# Altium schematic sheet 1_供电电路.schdoc
size 309 x 223 mm; Symbol: Sheet-Symbol_A4; Device: Sheet-Symbol_A4; @Page Name: 供电电路; @Create Date: 2023-06-22; @Page Count: 1; @Page No: 1; @Project Name: LED点阵最终版; @Schematic Name: Schematic2; @Update Date: 2023-06-22; Company: 嘉立创EDA; Page Size: A4; Version: V1.0
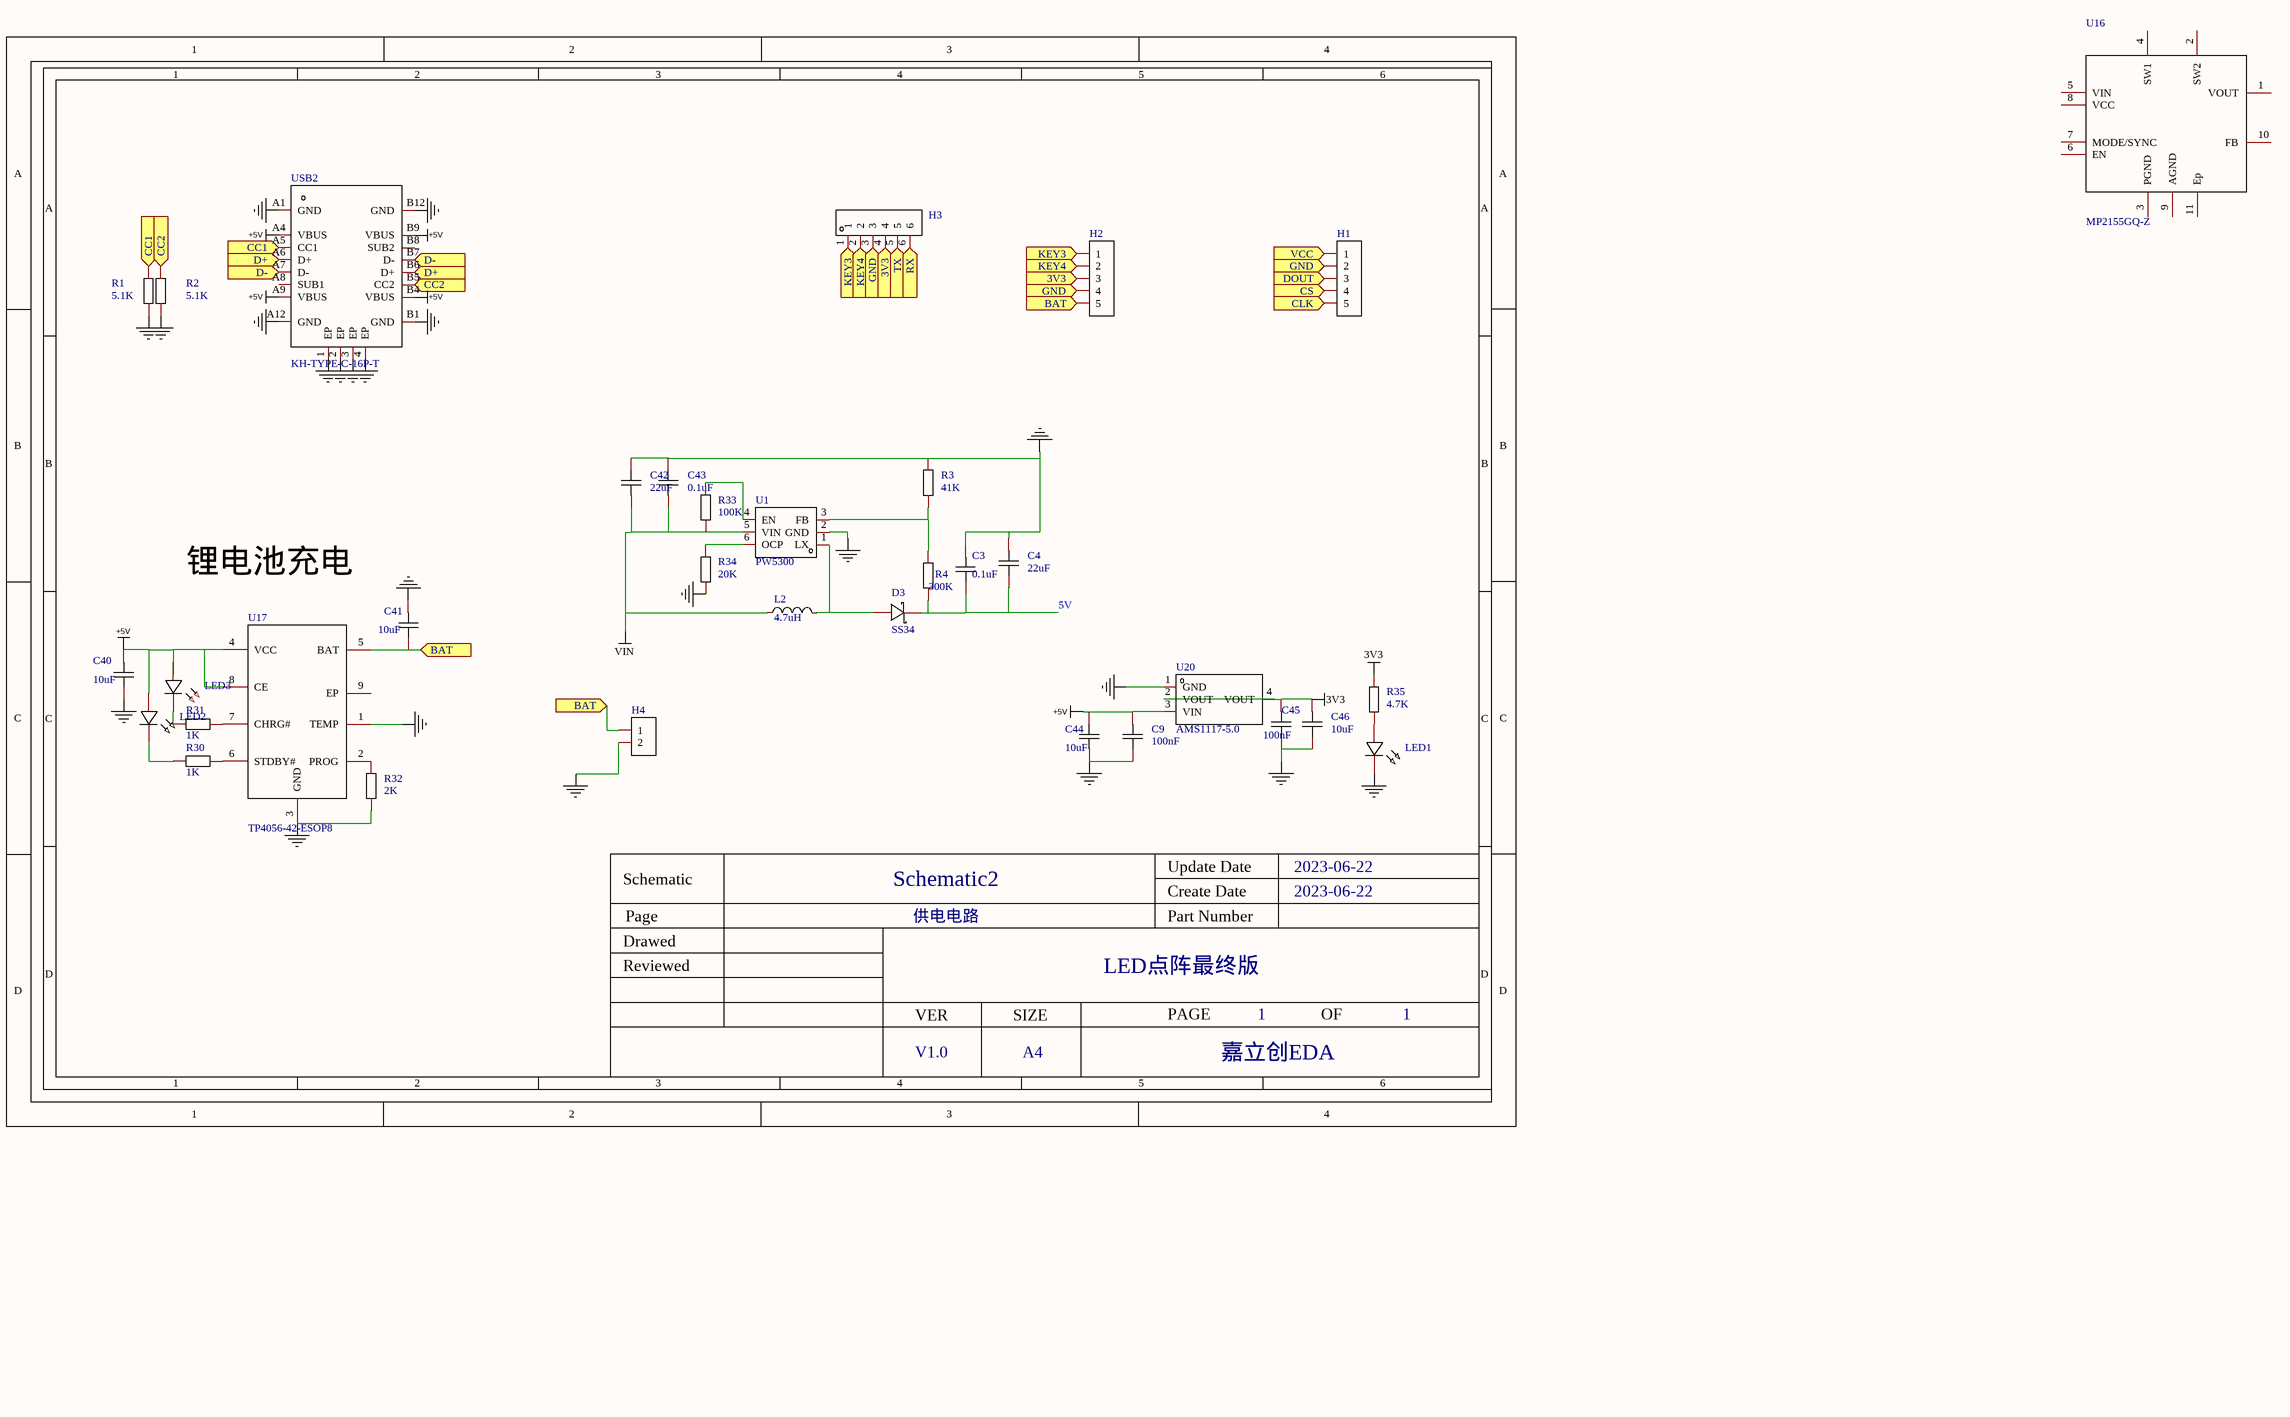
[diagram p0: 1_供电电路.schdoc]

## Parts
C3  0.1uF  [C0603]
C4  22uF  [C0603]
C9  100nF  [C0603]
C40  10uF  [C0603]
C41  10uF  [C0603]
C42  22uF  [C0603]
C43  0.1uF  [C0603]
C44  10uF  [C0603]
C45  100nF  [C0603]
C46  10uF  [C0603]
D3  SS34  [SMA_L4.3-W2.6-LS5.2-RD]
H1  HDR-F_2.54_1x5P  [HDR-TH_5P-P2.54-V-F]  (value not drawn)
H2  HDR-F_2.54_1x5P  [HDR-TH_5P-P2.54-V-F]  (value not drawn)
H3  HDR-F_2.54_1x6P  [HDR-TH_6P-P2.54-V-F]  (value not drawn)
H4  HDR-F_2.54_1x2P  [HDR-TH_2P-P2.54-V-F]  (value not drawn)
L2  4.7uH  [IND-SMD_L4.9-W4.4_MAPM0420F]
LED1  LED_0603-R  [LED_0603]  (value not drawn)
LED2  LED_0603-R  [LED_0603]  (value not drawn)
LED3  LED_0603-G  [LED_0603]  (value not drawn)
R1  5.1K  [R0603]
R2  5.1K  [R0603]
R3  41K  [R0603]
R4  300K  [R0603]
R30  1K  [R0603]
R31  1K  [R0603]
R32  2K  [R0603]
R33  100K  [R0603]
R34  20K  [R0603]
R35  4.7K  [R0603]
U1  PW5300  [SOT-23-6_L2.9-W1.6-P0.95-LS2.8-BL]
U16  MP2155GQ-Z  [QFN-10_L3.0-W3.0-P0.50-LS3.0-BL-EP]
U17  TP4056-42-ESOP8  [ESOP-8_L4.9-W3.9-P1.27-LS6.0-BL-EP]
U20  AMS1117-5.0  [SOT-223_L6.5-W3.5-P2.30-LS7.0-BR]
USB2  KH-TYPE-C-16P-T  [USB-C-SMD_KH-TYPE-C-16P]

## Ports
3V3 (in), BAT (in), CC1 (in), CC2 (in), CLK (in), CS (in), D+ (in), D- (in), DOUT (in), GND (in), KEY3 (in), KEY4 (in), RX (in), TX (in), VCC (in)

## Nets
3V3: C45.2 C46.2 R35.2 U20.2(VOUT) U20.4(VOUT)
+5V: C9.2 C40.2 C44.1 LED2.2(A) LED3.2(A) U17.4(VCC) U17.8(CE) U20.3(VIN) USB2.A4(VBUS) USB2.A9(VBUS) USB2.B4(VBUS) USB2.B9(VBUS)
NetC3_2: C3.2 C4.2 C9.1 C40.1 C41.2 C42.1 C43.1 C44.2 C45.1 C46.1 H4.2 LED1.1(C) R1.1 R2.1 R3.2 R32.2 R34.1 U1.2(GND) U17.1(TEMP) U17.3(GND) U20.1(GND) USB2.1(EP) USB2.2(EP) USB2.3(EP) USB2.4(EP) USB2.A1(GND) USB2.A12(GND) USB2.B1(GND) USB2.B12(GND)
VIN: C42.2 C43.2 L2.1 R33.2 U1.5(VIN)
3V3: H2.3 H3.4 ; port 3V3  [a separate net that carries the same name]
5V: C3.1 C4.1 D3.1(K) R4.1
BAT: C41.1 H2.5 H4.1 U17.5(BAT) ; port BAT
CC1: R1.2 USB2.A5(CC1) ; port CC1
CC2: R2.2 USB2.B5(CC2) ; port CC2
CLK: H1.5 ; port CLK
CS: H1.4 ; port CS
D+: USB2.A6(D+) USB2.B6(D+) ; port D+
D-: USB2.A7(D-) USB2.B7(D-) ; port D-
DOUT: H1.3 ; port DOUT
GND: H1.2 H2.4 H3.3 ; port GND
KEY3: H2.1 H3.1 ; port KEY3
KEY4: H2.2 H3.2 ; port KEY4
RX: H3.6 ; port RX
TX: H3.5 ; port TX
VCC: H1.1 ; port VCC
NetD3_2: D3.2(A) L2.2 U1.1(LX)
NetLED1_2: LED1.2(A) R35.1
NetLED2_1: LED2.1(C) R30.2
NetLED3_1: LED3.1(C) R31.2
NetR3_1: R3.1 R4.2 U1.3(FB)
NetR30_1: R30.1 U17.6(STDBY#)
NetR31_1: R31.1 U17.7(CHRG#)
NetR32_1: R32.1 U17.2(PROG)
NetR33_1: R33.1 U1.4(EN)
NetR34_2: R34.2 U1.6(OCP)

Not connected (* = marked no-connect by the designer): U16 1(VOUT) 2(SW2) 3(PGND) 4(SW1) 5(VIN) 6(EN) 7(MODE/SYNC) 8(VCC) 9(AGND) 10(FB) 11(Ep); U17 9(EP); USB2 A8(SUB1) B8(SUB2)

## Notes on the sheet
- 锂电池充电
- 1
- 2
- 3
- 4
- 5
- 6
- A
- B
- C
- Schematic
- Schematic2
- Create Date
- Update Date
- 2023-06-22
- Reviewed
- Drawed
- Page
- 供电电路
- Part Number
- LED点阵最终版
- D
- VER
- SIZE
- PAGE
- OF
- V1.0
- A4
- 嘉立创EDA

## Library data of the parts
C3 C4 C9 C40-C46 = CAP_0603: Symbol: CapAcitance; Convert to PCB: yes; Device: CAP_0603; Add into BOM: yes; Supplier Footprint: 0603
  C3 C43: Name: 0.1uF; Value: 0.1uF
  C4 C42: Name: 22uF; Value: 22uF
  C9 C45: Name: 100nF; Value: 100nF
  C40 C41 C44 C46: Name: 10uF; Value: 10uF
D3 = SS34_C8678: 二极管配置:独立式;直流反向耐压(Vr):40V;平均整流电流(Io):3A;正向压降(Vf):550mV@3A;; Manufacturer: MDD; Add into BOM: yes; Diode Configuration: 独立式; Reverse Voltage (Vr): 40V; Average Rectified Current (Io): 3A; Reverse Leakage Current (Ir): 500uA@40V; Name: SS34; Symbol: SS34_C8678; Device: SS34_C8678; LCSC Part Name: 40V 3A 550mV@3A; Supplier Part: C8678; Manufacturer Part: SS34; Supplier Footprint: SMA(DO-214AC); JLCPCB Part Class: Basic Part; Datasheet: https://atta.szlcsc.com/upload/public/pdf/source/20230314/A80AE34493C69B89E2F4B1712F433538.pdf; Supplier: LCSC; Convert to PCB: yes; Forward Voltage (Vf@If): 550mV@3A
H1 H2 = HDR-F_2.54_1x5P: Symbol: Header-Female-2.54_1x5; Convert to PCB: yes; Device: HDR-F_2.54_1x5P; Add into BOM: yes; Supplier Part: C50950; Supplier Footprint: 插件
H3 = HDR-F_2.54_1x6P: Symbol: Header-Female-2.54_1x6; Convert to PCB: yes; Device: HDR-F_2.54_1x6P; Add into BOM: yes; Supplier Part: C40877; Supplier Footprint: 插件
H4 = HDR-F_2.54_1x2P: Symbol: Header-Female-2.54_1x2; Convert to PCB: yes; Device: HDR-F_2.54_1x2P; Add into BOM: yes; Supplier Part: C49661; Supplier Footprint: 插件
L2 = HA42-4R7MT: 电感值:4.7uH;精度:±20%;额定电流:2A;饱和电流(Isat):3A;; Manufacturer: FH(风华); Add into BOM: yes; Tolerance: ±20%; Rated Current: 2A; Saturation Current (Isat): 3A; DC Resistance (DCR): 150mΩ; Name: 4.7uH; Symbol: HA42-4R7MT; Device: HA42-4R7MT; LCSC Part Name: 4.7uH ±20% 2A 150mΩ; Supplier Part: C2936653; Manufacturer Part: HA42-4R7MT; Supplier Footprint: 0420; JLCPCB Part Class: Extended Part; Datasheet: https://atta.szlcsc.com/upload/public/pdf/source/20211228/DF5AAD1C624D1DACD739A51BD94418BC.pdf; Supplier: LCSC; Convert to PCB: yes; Value: 4.7uH; Ratings: -
LED1 LED2 = LED_0603-R: Symbol: LED_R; Convert to PCB: yes; Device: LED_0603-R; Add into BOM: yes; Supplier Footprint: 0603
LED3 = LED_0603-G: Symbol: LED_G; Convert to PCB: yes; Device: LED_0603-G; Add into BOM: yes; Supplier Footprint: 0603
R1-R4 R30-R35 = Res_0603: Symbol: 电阻; Convert to PCB: yes; Device: Res_0603; Add into BOM: yes; Supplier Footprint: 0603
  R1 R2: Name: 5.1K; Value: 5.1K
  R3: Name: 41K; Value: 41K
  R4: Name: 300K; Value: 300K
  R30 R31: Name: 1K; Value: 1K
  R32: Name: 2K; Value: 2K
  R33: Name: 100K; Value: 100K
  R34: Name: 20K; Value: 20K
  R35: Name: 4.7K; Value: 4.7K
U1 = PW5300: Add into BOM: yes; Name: PW5300; Symbol: PW5300; Device: PW5300; LCSC Part Name: PW5300; Supplier Part: C9900019345; Manufacturer Part: PW5300; Supplier Footprint: SOT-23-6; JLCPCB Part Class: Extended Part; Datasheet: https://atta.szlcsc.comnull; Supplier: LCSC; Convert to PCB: yes
U16 = MP2155GQ-Z: -; Manufacturer: MPS; Add into BOM: yes; Name: MP2155GQ-Z; Symbol: MP2155GQ-Z; Device: MP2155GQ-Z; LCSC Part Name: MP2155GQ-Z; Supplier Part: C110397; Manufacturer Part: MP2155GQ-Z; Supplier Footprint: QFN-10(3x3); JLCPCB Part Class: 扩展库; Datasheet: https://atta.szlcsc.com/upload/public/pdf/source/20230320/112C0AF2526F5487DC282A43404EEABA.pdf; Supplier: LCSC; Convert to PCB: yes
U17 = TP4056-42-ESOP8: 锂电池充电芯片; Manufacturer: TOPPOWER(南京拓微); Symbol: TP4056; Add into BOM: yes; Name: TP4056-42-ESOP8; Device: TP4056-42-ESOP8; LCSC Part Name: TP4056-42-ESOP8 编带; Supplier Part: C16581; Manufacturer Part: TP4056-42-ESOP8; Supplier Footprint: ESOP-8; JLCPCB Part Class: 基础库; Datasheet: https://atta.szlcsc.com/upload/public/pdf/source/20160713/1468379849914.pdf; Supplier: LCSC; Convert to PCB: yes; NO_CONNECT: yes
U20 = AMS1117-5.0_C6187: 输出类型:固定;输出极性:正;最大输入电压:15V;输出电压:5V;输出电流:1A;电源纹波抑制比(PSRR):68dB@(120Hz);; Manufacturer: AMS; Add into BOM: yes; Output Type: 固定; Output Polarity: 正; Number of Outputs: 1; Maximum Input Voltage: 15V; Output Voltage: 5V; Dropout Voltage: 1.3V@(1A); Output Current: 1A; Name: AMS1117-5.0; Symbol: AMS1117-5.0; Device: AMS1117-5.0_C6187; LCSC Part Name: AMS1117-5.0; Supplier Part: C6187; Manufacturer Part: AMS1117-5.0; Supplier Footprint: SOT-223; JLCPCB Part Class: 基础库; Datasheet: https://atta.szlcsc.com/upload/public/pdf/source/20180727/C6186_7A095716F0823C02F1997A905E26C086.pdf; Supplier: LCSC; Convert to PCB: yes; Power Supply Rejection Ratio (PSRR): 68dB@(120Hz)
USB2 = KH-TYPE-C-16P-T: 连接器类型:Type-C;标准:-;公母:母座;触点数量:16;端口数量:1;安装方式:卧贴;额定电流 - 电源:500mA;工作温度范围:-30℃~+80℃;; Manufacturer: kinghelm(金航标); Add into BOM: yes; Connector Type: Type-C; Gender: 母座; Number of Contacts: 16; Number of Ports: 1; Current Rating - Power (Max): 500mA; Name: KH-TYPE-C-16P-T; Symbol: KH-TYPE-C-16P-T; Device: KH-TYPE-C-16P-T; LCSC Part Name: Type-C 母座 卧贴; Supplier Part: C709358; Manufacturer Part: KH-TYPE-C-16P-T; Supplier Footprint: SMD; JLCPCB Part Class: 扩展库; Datasheet: https://atta.szlcsc.com/upload/public/pdf/source/20200722/C709358_5A99A991362FD50EC94EB58A838F95BB.pdf; Supplier: LCSC; Convert to PCB: yes; Standard: -; Mounting Style: 卧贴; Operating Temperature Range: -30℃~+80℃; NO_CONNECT: yes